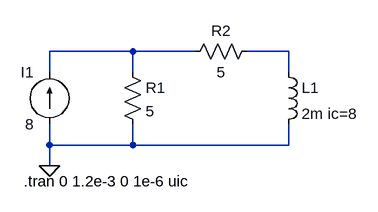
[diagram p0: schematic tran_network2.asc]
tran_network2.asc, the LTspice schematic file:
Version 4
SHEET 1 880 680
WIRE 240 96 112 96
WIRE 336 96 240 96
WIRE 480 96 416 96
WIRE 112 128 112 96
WIRE 240 128 240 96
WIRE 480 128 480 96
WIRE 112 240 112 208
WIRE 240 240 240 208
WIRE 240 240 112 240
WIRE 480 240 480 208
WIRE 480 240 240 240
WIRE 112 272 112 240
FLAG 112 272 0
SYMBOL current 112 208 R180
WINDOW 0 24 80 Left 2
WINDOW 3 24 0 Left 2
WINDOW 123 0 0 Left 2
WINDOW 39 0 0 Left 2
SYMATTR InstName I1
SYMATTR Value 8
SYMBOL res 224 112 R0
SYMATTR InstName R1
SYMATTR Value 5
SYMBOL res 432 80 R90
WINDOW 0 0 56 VBottom 2
WINDOW 3 32 56 VTop 2
SYMATTR InstName R2
SYMATTR Value 5
SYMBOL ind 464 112 R0
SYMATTR InstName L1
SYMATTR Value 2m ic=8
SYMATTR SpiceLine Rser=0
TEXT 72 296 Left 2 !.tran 0 1.2e-3 0 1e-6 uic

The netlist it stands for:
* tran_network2.asc
I1 0 N001 8
R1 N001 0 5
R2 N002 N001 5
L1 N002 0 2m ic=8 Rser=0
.tran 0 1.2e-3 0 1e-6 uic
.backanno
.end